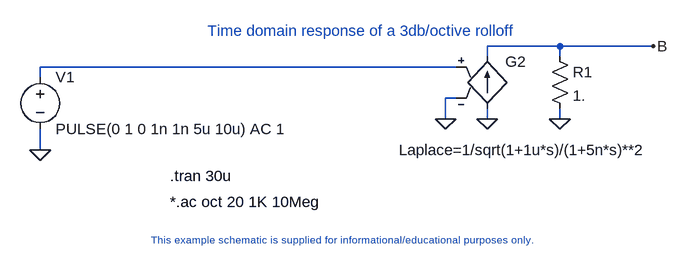
[diagram p0: schematic HalfSlope.asc]
HalfSlope.asc, the LTspice schematic file:
Version 4
SHEET 1 1640 904
WIRE 1344 560 1232 560
WIRE 1488 560 1344 560
WIRE 1232 576 1232 560
WIRE 1344 576 1344 560
WIRE 1184 592 544 592
WIRE 544 608 544 592
WIRE 1184 640 1168 640
WIRE 1168 672 1168 640
WIRE 1232 672 1232 656
WIRE 1344 672 1344 656
WIRE 544 720 544 688
FLAG 544 720 0
FLAG 1344 672 0
FLAG 1232 672 0
FLAG 1168 672 0
FLAG 1488 560 B
SYMBOL voltage 544 592 R0
SYMATTR InstName V1
SYMATTR Value PULSE(0 1 0 1n 1n 5u 10u) AC 1
SYMBOL g 1232 560 R0
WINDOW 0 28 24 Left 2
WINDOW 3 -136 160 Left 2
SYMATTR InstName G2
SYMATTR Value Laplace=1/sqrt(1+1u*s)/(1+5n*s)**2
SYMBOL res 1328 560 R0
SYMATTR InstName R1
SYMATTR Value 1.
TEXT 744 800 Left 2 !*.ac oct 20 1K 10Meg
TEXT 744 760 Left 2 !.tran 30u
TEXT 1040 552 Bottom 2 ;Time domain response of a 3db/octive rolloff
TEXT 1000 848 Top 1 ;This example schematic is supplied for informational/educational purposes only.

The netlist it stands for:
* HalfSlope.asc
V1 N001 0 PULSE(0 1 0 1n 1n 5u 10u) AC 1
G2 0 B N001 0 Laplace=1/sqrt(1+1u*s)/(1+5n*s)**2
R1 B 0 1.
*.ac oct 20 1K 10Meg
.tran 30u
* Time domain response of a 3db/octive rolloff
* This example schematic is supplied for informational/educational purposes only.
.backanno
.end